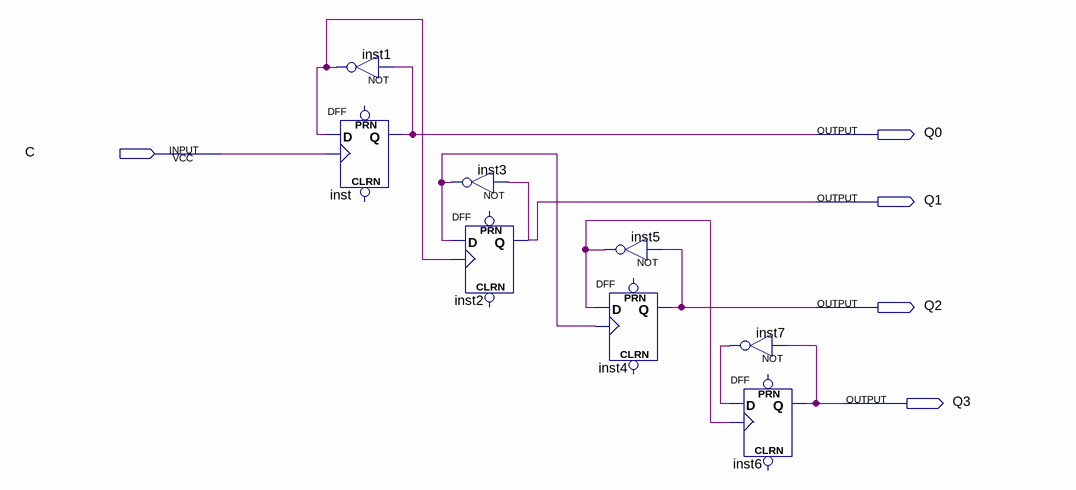
[diagram p0: schematic sheet]
// Quartus schematic lab2.bdf as structural Verilog: 8 symbols, 5 pins
module lab2 (
  input  C,
  output Q0,
  output Q1,
  output Q2,
  output Q3
);

  wire inst1_out, inst3_out, inst5_out, inst7_out;

  not inst1 (inst1_out, Q0);
  DFF inst (.CLK(C), .D(inst1_out), .Q(Q0));  // open: CLRN, PRN
  not inst3 (inst3_out, Q1);
  DFF inst2 (.CLK(inst1_out), .D(inst3_out), .Q(Q1));  // open: CLRN, PRN
  not inst5 (inst5_out, Q2);
  DFF inst4 (.CLK(inst3_out), .D(inst5_out), .Q(Q2));  // open: CLRN, PRN
  not inst7 (inst7_out, Q3);
  DFF inst6 (.CLK(inst5_out), .D(inst7_out), .Q(Q3));  // open: CLRN, PRN
endmodule
